# Altium schematic sheet TagConnectProgrammer.SchDoc
size A4; SheetNumber: 1; SheetTotal: 1
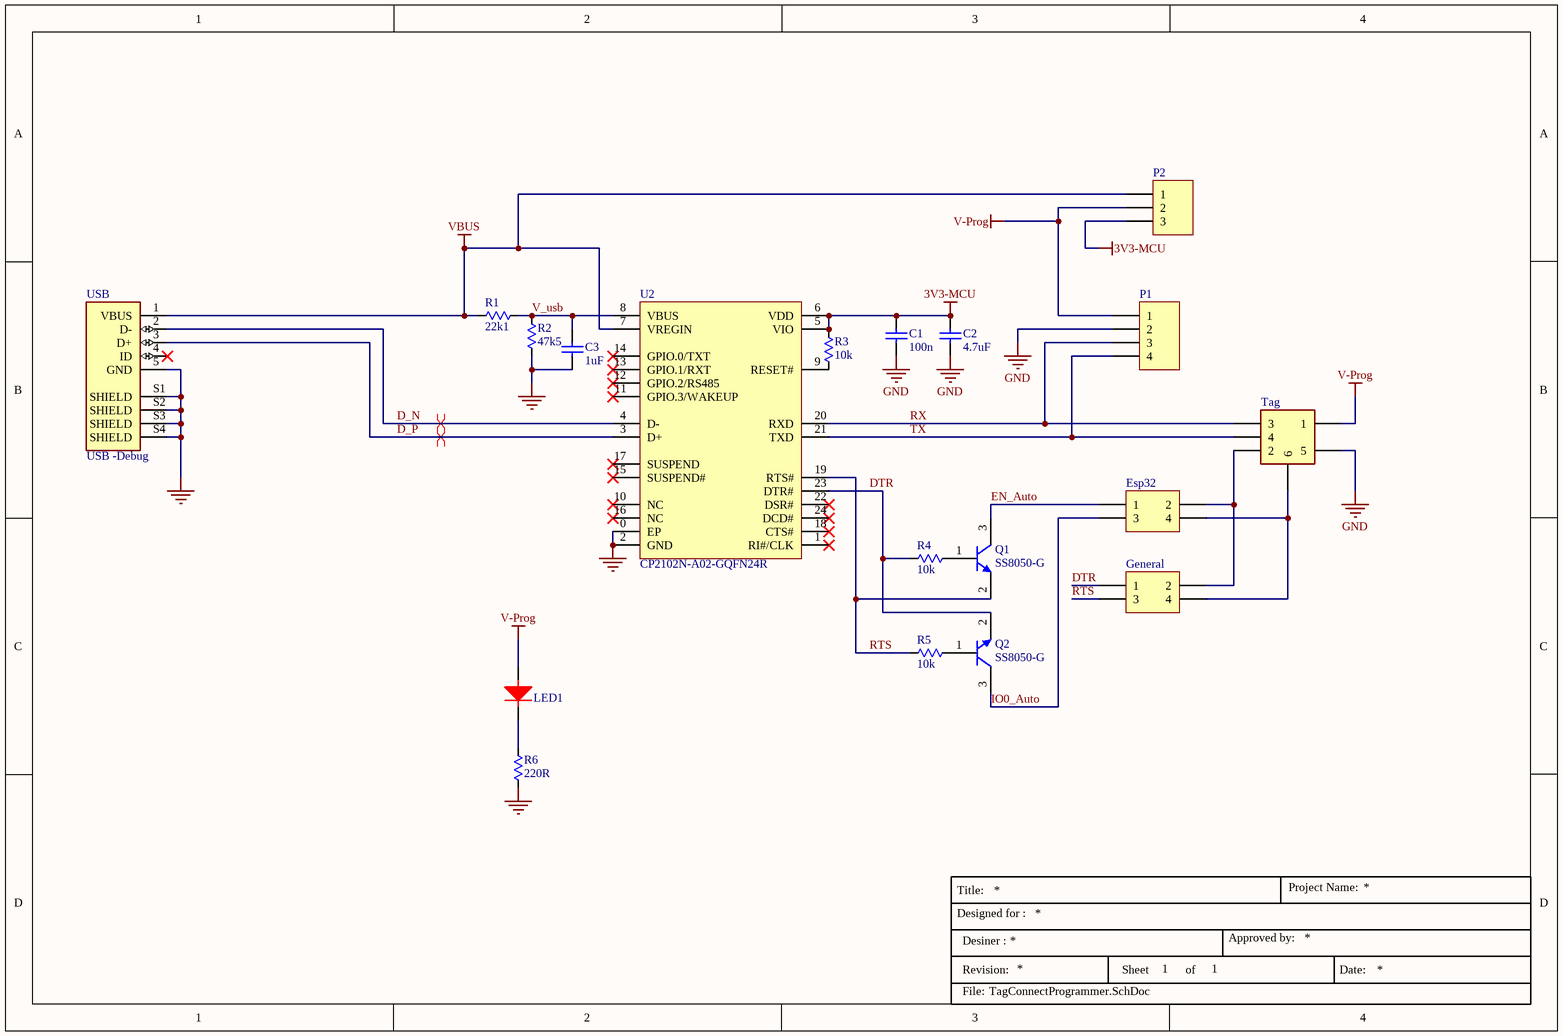
[diagram p0: TagConnectProgrammer.SchDoc]

## Parts
C1  100n  [0603C]
C2  4.7uF  [0603C]
C3  1uF  [0603C]
Esp32  Header 2X2  [HDR2X2]  (value not drawn)
General  Header 2X2  [HDR2X2]  (value not drawn)
LED1  150060VS55040  [Würth_Elektronik_0_MFG]  (value not drawn)
P1  Header 4  [HDR1X4]  (value not drawn)
P2  Header 3  [HDR1X3]  (value not drawn)
Q1  SS8050-G  [SOT95P240X115-3N]
Q2  SS8050-G  [SOT95P240X115-3N]
R1  22k1  [0603R]
R2  47k5  [0603R]
R3  10k  [0603R]
R4  10k  [0603R]
R5  10k  [0603R]
R6  220R  [0603R]
Tag  Header 3X2H BOX  [SHDRRA6W64P254X254_2X3_1528X885X910P]  (value not drawn)
U2  CP2102N-A02-GQFN24R  [QFN50P400X400X80-25N]
USB  USB -Debug  [MOLEX_47642-0001]

## Nets
3V3-MCU: C1.2 C2.2 P2.3 R3.2 U2.5(VIO) U2.6(VDD)
GND: C1.1 C2.1 C3.1 P1.2 R2.1 R6.1 Tag.5 U2.0(EP) U2.2(GND) USB.5(GND) USB.S1(SHIELD) USB.S2(SHIELD) USB.S3(SHIELD) USB.S4(SHIELD)
V-Prog: LED1.2(+) P1.1 P2.2 Tag.1
VBUS: P2.1 R1.1 U2.7(VREGIN) USB.1(VBUS)
D_N: U2.4(D-) USB.2(D-)
D_P: U2.3(D+) USB.3(D+)
DTR: General.1 Q2.2(E) R4.2 U2.23(DTR#)
EN_Auto: Esp32.1 Q1.3(C)
IO0_Auto: Esp32.3 Q2.3(C)
RTS: General.3 Q1.2(E) R5.2 U2.19(RTS#)
RX: P1.3 Tag.3 U2.20(RXD)
TX: P1.4 Tag.4 U2.21(TXD)
V_usb: C3.2 R1.2 R2.2 U2.8(VBUS)
NetEsp32_2: Esp32.2 General.2 Tag.2
NetEsp32_4: Esp32.4 General.4 Tag.6
NetLED1_1: LED1.1(-) R6.2
NetQ1_1: Q1.1(B) R4.1
NetQ2_1: Q2.1(B) R5.1
NetR3_1: R3.1 U2.9(RESET#)

Not connected (* = marked no-connect by the designer): U2 1(RI#/CLK)* 10(NC)* 11(GPIO.3/WAKEUP)* 12(GPIO.2/RS485)* 13(GPIO.1/RXT)* 14(GPIO.0/TXT)* 15(SUSPEND#)* 16(NC)* 17(SUSPEND)* 18(CTS#)* 22(DSR#)* 24(DCD#)*; USB 4(ID)*

## Layout directives
differential pair: D_N, D_P

## Notes on the sheet
- Title:
- Designed for :
- Project Name:
- Desiner :
- Revision:
- Sheet
- of
- Approved by:
- Date:
- File:

## Library data of the parts
C1 = 100n: Multilayer Ceramic Capacitors MLCC - SMD/SMT 16V 0.1uF X7R 0603 10%; MPn1: C0603C104K4RACTU; Manufacturer 1: KEMET; Mouser Pn2: *; Mouser Pn1: 80-C0603C104K4R; Manufacturer 2: *; Digikey Pn2: *; MPn2: *; Digikey Pn1: *
C2 = 4.7uF: Multilayer Ceramic Capacitors MLCC - SMD/SMT 4.7uF+/-10% 10V X5R 1608; MPn1: CL10A475KP8NNNC; Manufacturer 1: Samsung Electro-Mechanics; Mouser Pn2: *; Mouser Pn1: 187-CL10A475KP8NNNC; Manufacturer 2: *; Digikey Pn2: *; MPn2: *
C3 = 1uF: Multilayer Ceramic Capacitors MLCC - SMD/SMT 1uF+/-10% 10V X5R 1608; MPn1: CL10A105KP8NNWC; Manufacturer 1: Samsung Electro-Mechanics; Mouser Pn1: 187-CL10A105KP8NNWC; Manufacturer 2: *; Mouser Pn2: *; Digikey Pn2: *; Digikey Pn1: *; MPn2: *
Esp32 General = Header 2X2: Header, 4-Pin, Dual row 100 mil; LatestRevisionDate: 17-Jul-2002; LatestRevisionNote: Re-released for DXP Platform.; Publisher: Altium Limited
LED1 = LED R: Standard LEDs - SMD SMD 0603 RED; Manufacturer 1: Dialight; MPn1: 599-0010-007F; Digikey Pn1: *; Digikey Pn2: *; Manufacturer 2: *; Mouser Pn1: 645-599-0010-007F; Mouser Pn2: *; MPn2: *
P1 = Header 4: Header, 4-Pin,One row 100 mil; LatestRevisionDate: 17-Jul-2002; LatestRevisionNote: Re-released for DXP Platform.; Publisher: Altium Limited
P2 = Header 3: Header, 3-Pin,One row 100 mil; LatestRevisionDate: 17-Jul-2002; LatestRevisionNote: Re-released for DXP Platform.; Publisher: Altium Limited
Q1 Q2 = SS8050-G: NPN TRANSISTOR 1.5A 40V SOT-23 R; Manufacturer 1: Comchip Technology; Digikey Pn1: 641-1790-1-ND; MPn1: SS8050-G; Mouser Pn1: 750-SS8050-G; Manufacturer 2: *; MPn2: *; Digikey Pn2: *; Mouser Pn2: *
R1 = 22k1: Thick Film Resistors - SMD 0603 22Kohms 1% AEC-Q200; Manufacturer 1: Panasonic; MPn1: ERJ-3EKF2212V; Digikey Pn1: *; Digikey Pn2: *; Manufacturer 2: *; Mouser Pn1: 667-ERJ-3EKF2212V; Mouser Pn2: *; MPn2: *
R2 = 47k5: Thin Film Resistors - SMD 1/8W 47.5K ohm 1% 50ppm; Manufacturer 1: YAGEO; MPn1: RT0603BRD0747K5L; Digikey Pn1: *; Digikey Pn2: *; Manufacturer 2: *; Mouser Pn1: 603-RT0603BRD0747K5L; Mouser Pn2: *; MPn2: *
R3-R5 = 10k: Thick Film Resistors - SMD 0603 10Kohms 1% AEC-Q200; Manufacturer 1: Panasonic; MPn1: ERJ-3EKF1002V; Digikey Pn1: *; Digikey Pn2: *; Manufacturer 2: *; Mouser Pn1: 667-ERJ-3EKF1002V; Mouser Pn2: *; MPn2: *
R6 = 220R: Thick Film Resistors - SMD 220 Ohms 100-200 mW 0603 1%; Manufacturer 1: YAGEO; MPn1: RC0603FR-13220RL; Digikey Pn1: *; Digikey Pn2: *; Manufacturer 2: *; Mouser Pn1: 603-RC0603FR-13220RL; Mouser Pn2: *; MPn2: *
Tag = Header 3X2H BOX: Headers & Wire Housings WR-BHD 2.54mm Male 6P Angl Gold BoX Hdr; Manufacturer_Name: Wurth Elektronik; Manufacturer_Part_Number: 61200621721; Datasheet Link: http://uk.rs-online.com/web/p/products/8236468; Height: 9.1mm; Mouser Part Number: 710-61200621721; Mouser Price/Stock: https://www.mouser.co.uk/ProductDetail/Wurth-Elektronik/61200621721?qs=PhR8RmCirEbh0%2F%252BOR%252BGA%252BA%3D%3D
U2 = CP2102N-A02-GQFN20R: IC USB TO UART BRIDGE QFN24; Manufacturer 1: Silicon Labs; MPn1: CP2102N-A02-GQFN24; Digikey Pn1: 336-5888-1-ND; Mouser Pn1: 634-CP2102NA02QFN24; Manufacturer 2: *; MPn2: *; Mouser Pn2: *; Digikey Pn2: *
USB = USB - micro B: USB - micro B Receptacle Connector 5 Position Board Edge, Cutout; Surface Mount, Right Angle; Manufacturer 1: Molex; MPn1: 47642-0001; Digikey Pn2: *; Mouser Pn2: *; MPn2: *; Manufacturer 2: *; Digikey Pn1: *; Mouser Pn1: 538-47642-0001